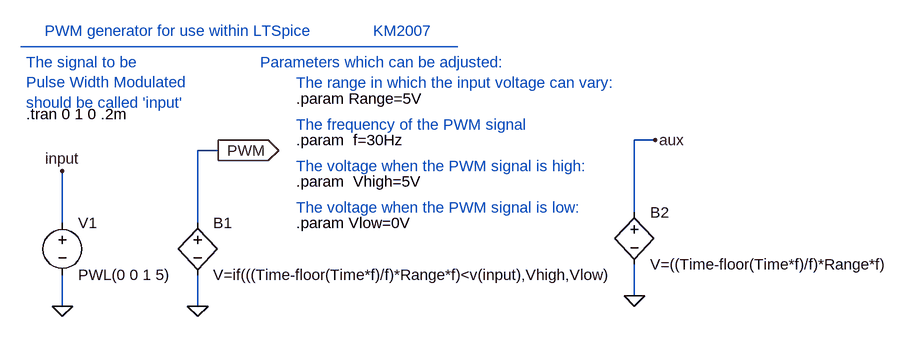
[diagram p0: schematic pwm.asc]
pwm.asc, the LTspice schematic file:
Version 4
SHEET 1 1572 680
WIRE 800 -160 768 -160
WIRE 128 -144 96 -144
WIRE 768 -48 768 -160
WIRE -112 -32 -112 -112
WIRE 96 -32 96 -144
WIRE 768 80 768 32
WIRE -112 96 -112 48
WIRE 96 96 96 48
FLAG 96 96 0
FLAG -112 96 0
FLAG -112 -112 input
FLAG 128 -144 PWM
IOPIN 128 -144 Out
FLAG 768 80 0
FLAG 800 -160 aux
SYMBOL bv 96 -48 R0
SYMATTR InstName B1
SYMATTR Value V=if(((Time-floor(Time*f)/f)*Range*f)<v(input),Vhigh,Vlow)
SYMBOL voltage -112 -48 R0
WINDOW 123 0 0 Left 0
WINDOW 39 0 0 Left 0
SYMATTR InstName V1
SYMATTR Value PWL(0 0 1 5)
SYMBOL bv 768 -64 R0
SYMATTR InstName B2
SYMATTR Value V=((Time-floor(Time*f)/f)*Range*f)
TEXT -168 -200 Left 0 !.tran 0 1 0 .2m
TEXT 248 -224 Left 0 !.param Range=5V
TEXT 248 -160 Left 0 !.param  f=30Hz
TEXT 248 -96 Left 0 !.param  Vhigh=5V
TEXT 192 -280 Left 0 ;Parameters which can be adjusted:
TEXT 248 -248 Left 0 ;The range in which the input voltage can vary:
TEXT 248 -184 Left 0 ;The frequency of the PWM signal
TEXT 248 -32 Left 0 !.param Vlow=0V
TEXT 248 -120 Left 0 ;The voltage when the PWM signal is high:
TEXT 248 -56 Left 0 ;The voltage when the PWM signal is low:
TEXT 160 -328 Center 0 ;PWM generator for use within LTSpice              KM2007
TEXT -168 -280 Left 0 ;The signal to be \nPulse Width Modulated \nshould be called 'input'
LINE Normal 496 -304 -176 -304

The netlist it stands for:
* pwm.asc
B1 PWM 0 V=if(((Time-floor(Time*f)/f)*Range*f)<v(input),Vhigh,Vlow)
V1 input 0 PWL(0 0 1 5)
B2 aux 0 V=((Time-floor(Time*f)/f)*Range*f)
.tran 0 1 0 .2m
.param Range=5V
.param  f=30Hz
.param  Vhigh=5V
* Parameters which can be adjusted:
* The range in which the input voltage can vary:
* The frequency of the PWM signal
.param Vlow=0V
* The voltage when the PWM signal is high:
* The voltage when the PWM signal is low:
* PWM generator for use within LTSpice              KM2007
* The signal to be
* Pulse Width Modulated
* should be called 'input'
.backanno
.end